# Altium schematic sheet Sample_FPC_FFC_TestBoard.SchDoc
size A3; SheetNumber: 5; SheetTotal: 5
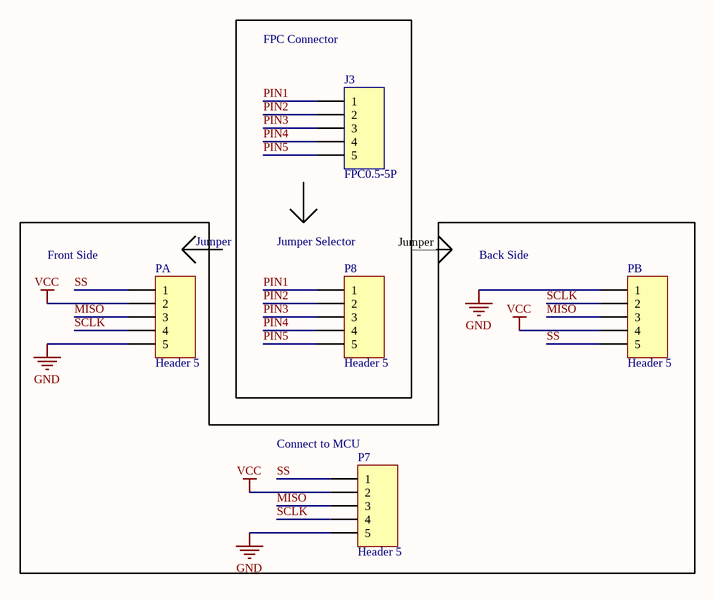
[diagram p0: Sample_FPC_FFC_TestBoard.SchDoc]

## Parts
J3  FPC0.5-5P  [FPC0.5-5P]
P7  Header 5  [HDR1X5]
P8  Header 5  [HDR1X5-2]
PA  Header 5  [HDR1X5-2]
PB  Header 5  [HDR1X5-2]

## Nets
GND: P7.5 PA.5 PB.1
VCC: P7.2 PA.2 PB.4
MISO: P7.3 PA.3 PB.3
PIN1: J3.1 P8.1
PIN2: J3.2 P8.2
PIN3: J3.3 P8.3
PIN4: J3.4 P8.4
PIN5: J3.5 P8.5
SCLK: P7.4 PA.4 PB.2
SS: P7.1 PA.1 PB.5

## Notes on the sheet
- FPC Connector
- Front Side
- Jumper
- (near P8) Jumper Selector
- Back Side
- (near P7) Connect to MCU

## Library data of the parts
P7 P8 PA PB = Header 5: Header, 4-Pin; LatestRevisionDate: 17-Jul-2002; LatestRevisionNote: Re-released for DXP Platform.; Publisher: Altium Limited